# EAGLE design BUZZI-15 (EAGLE 4.15)
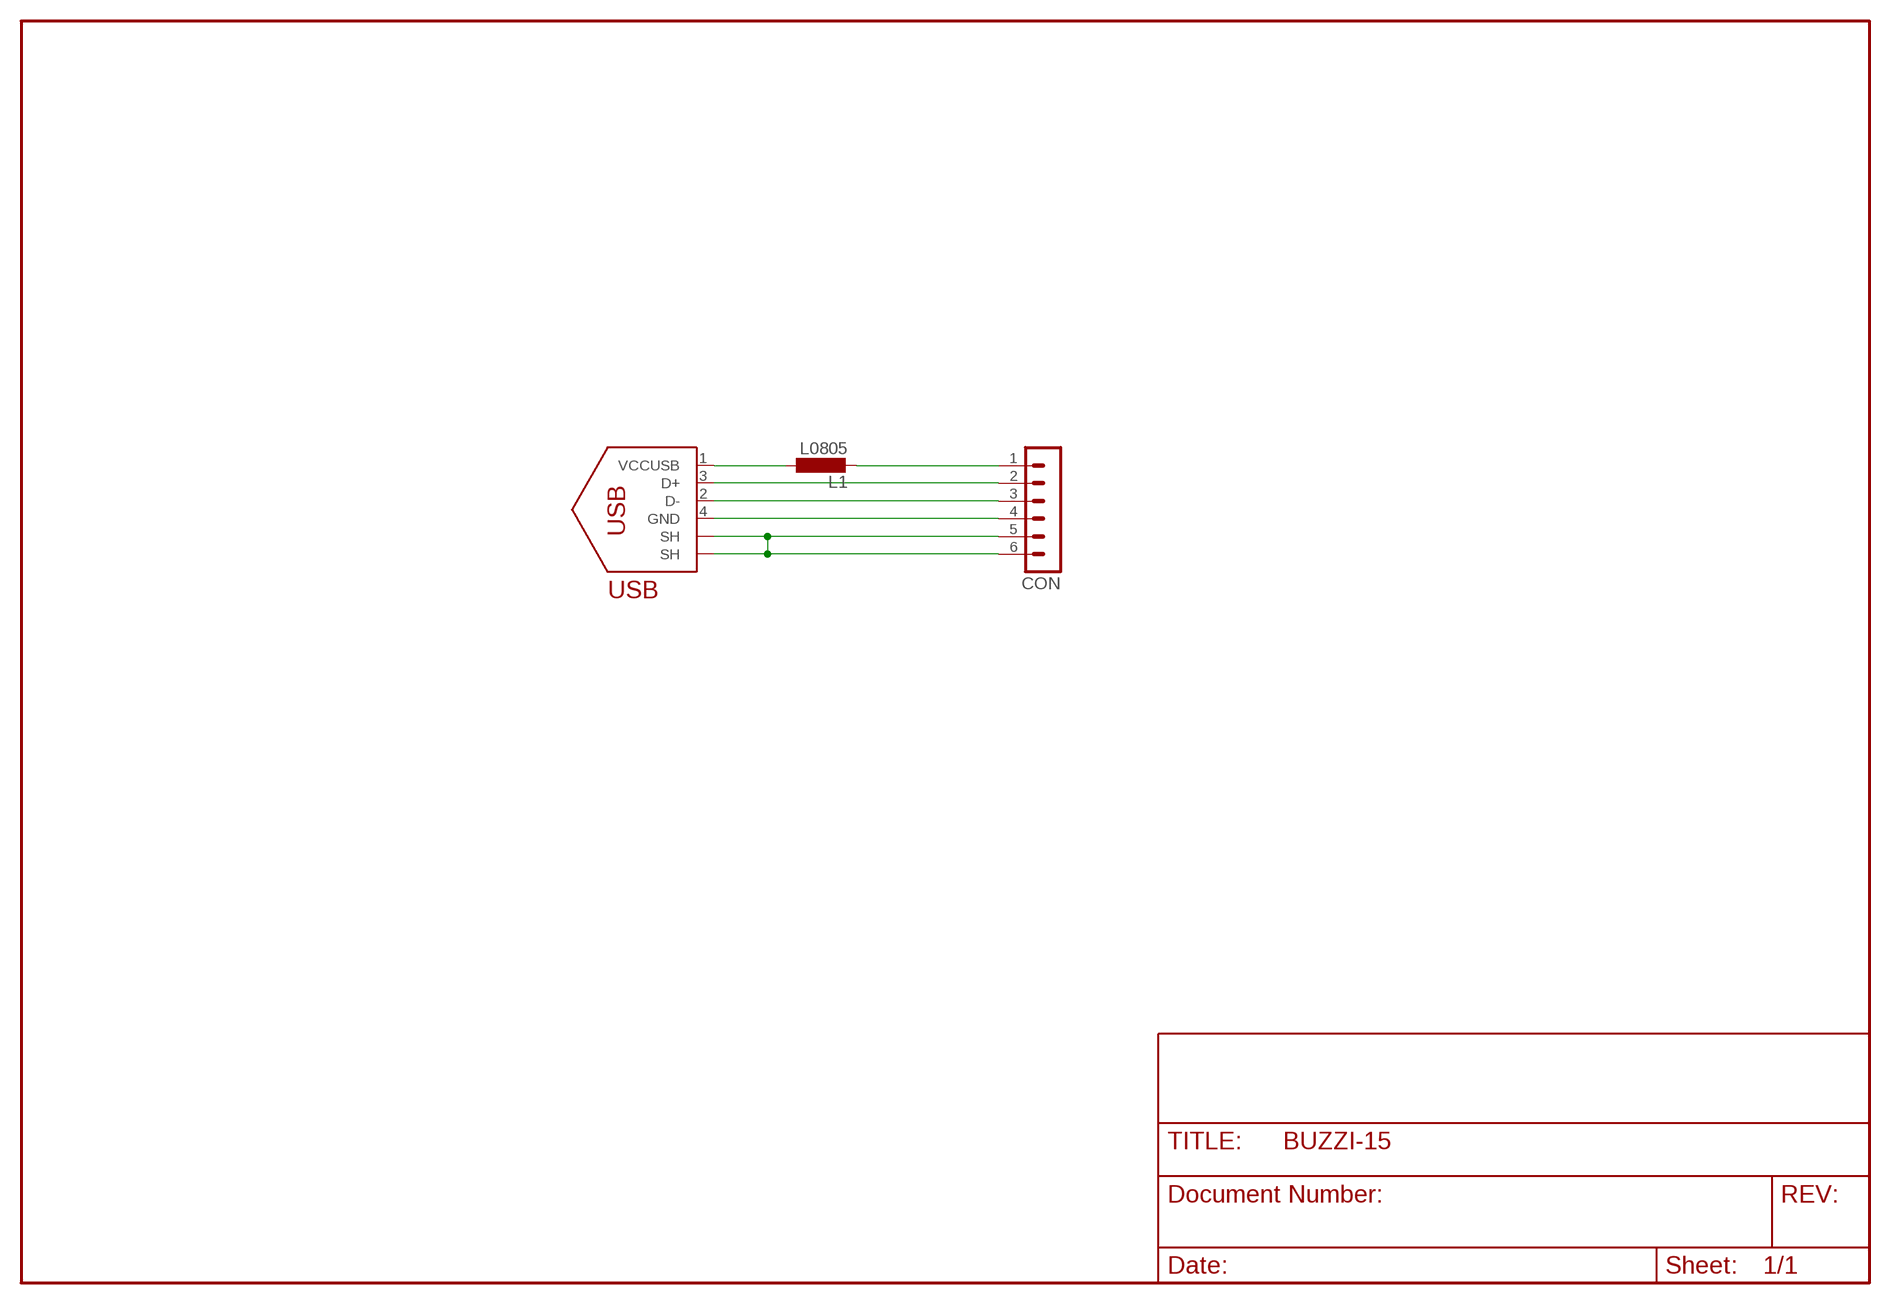
[diagram p0: schematic, sheet 1]

## Parts
CON  MA06-1  [MA06-1]
L1  L0805  [C0805]
USB  USBCONN  [PN61729]

## Nets
N$1: L1.1 USB.1(VCCUSB)
N$2: CON.2 USB.3(D+)
N$3: CON.3 USB.2(D-)
N$4: CON.4 USB.4(GND)
N$7: CON.1 L1.2
SH: CON.5 CON.6 USB.SHIELD1(SH) USB.SHIELD2(SH)

## Library data of the parts
CON = con-lstb:MA06-1: PIN HEADER
L1 = turbod3:L
USB = turbod3:USBCONN

## Board
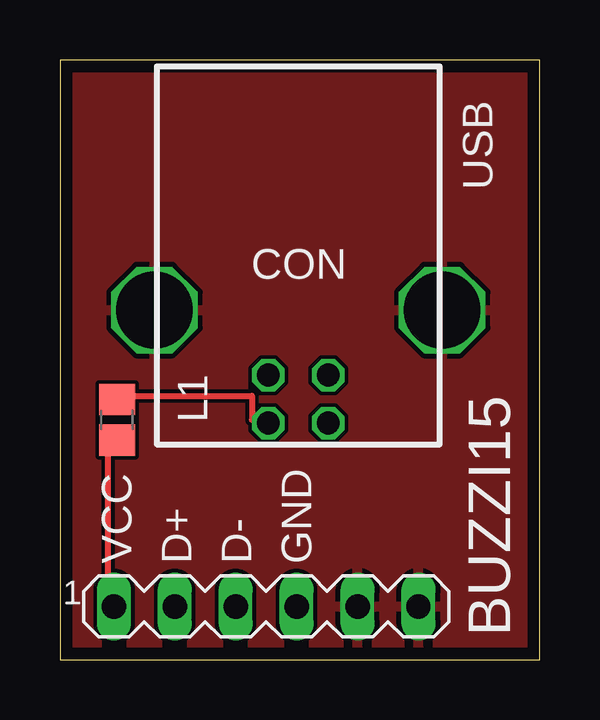
[diagram p1: board, top side]
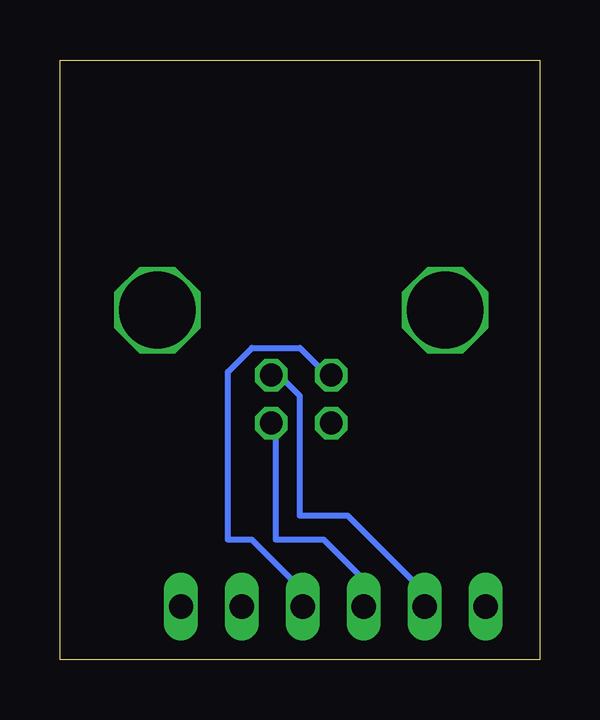
[diagram p2: board, bottom side, seen from below]

Size 20 x 25 mm. Coordinates in mm from the lower left corner, seen from the top.
Outline: 0,0 20,0 20,25 0,25 0,0
Copper layers (1*16): Top 0.035mm / dielectric 1.5mm / Bottom 0.035mm
Design rules "PCB-POOL": minimum track width 6mil, minimum drill 12mil, track to track 6mil, track to pad 6mil, pad to pad 6mil, via to via 6mil, smd to smd 6mil, copper to edge 20mil, drill to drill 8mil, minimum pad ring 8mil, minimum via ring 6mil, stop-mask expansion 3mil, vias tented up to drill 0mil, thermal gap 8mil

### Footprints (pad centres in the part's own frame; a part is rotated, then mirrored left to right if it is on the bottom)
MA06-1 = drill 1.016 long: 1 -6.35,0; 2 -3.81,0; 3 -1.27,0; 4 1.27,0; 5 3.81,0; 6 6.35,0
C0805 = smd 1.3 x 1.5: 1 -0.85,0; 2 0.85,0
PN61729 = drill 0.95 octagon: 1 1.25,4.71; 2 -1.25,4.71; 3 -1.25,2.71; 4 1.25,2.71 | drill 3.2 octagon: SHIELD1 -6,0; SHIELD2 6,0

### Placement (x,y rotation side)
CON  8.6,2.21 0 top
L1  2.38,10 270 top
USB  9.94,14.57 180 top

### Tracks (layer width: path | path; a pad name or v marks a point on that pad's centre or on a via)
N$1
  Top 0.254: L1.1 3,11 8,11 8,10 USB.1
N$2
  Bottom 0.254: USB.3 11,12 10,11 10,6 8,6 5,3 CON.2
N$3
  Bottom 0.254: USB.2 11,10 11,5 9,5 7,3 CON.3
N$4
  Bottom 0.254: USB.4 9,12 10,13 12,13 13,12 13,5 12,5 10,3 CON.4
N$7
  Top 0.254: L1.2 2,9 2,3 CON.1
SH
  pour Top: 0.5,24.5 19.5,24.5 19.5,0.5 0.5,0.5

### Text on the board
tNames: BUZZI15 | VCC | D+ | D- | GND